# EAGLE design NEW_oct_6 (EAGLE 9.6.2)
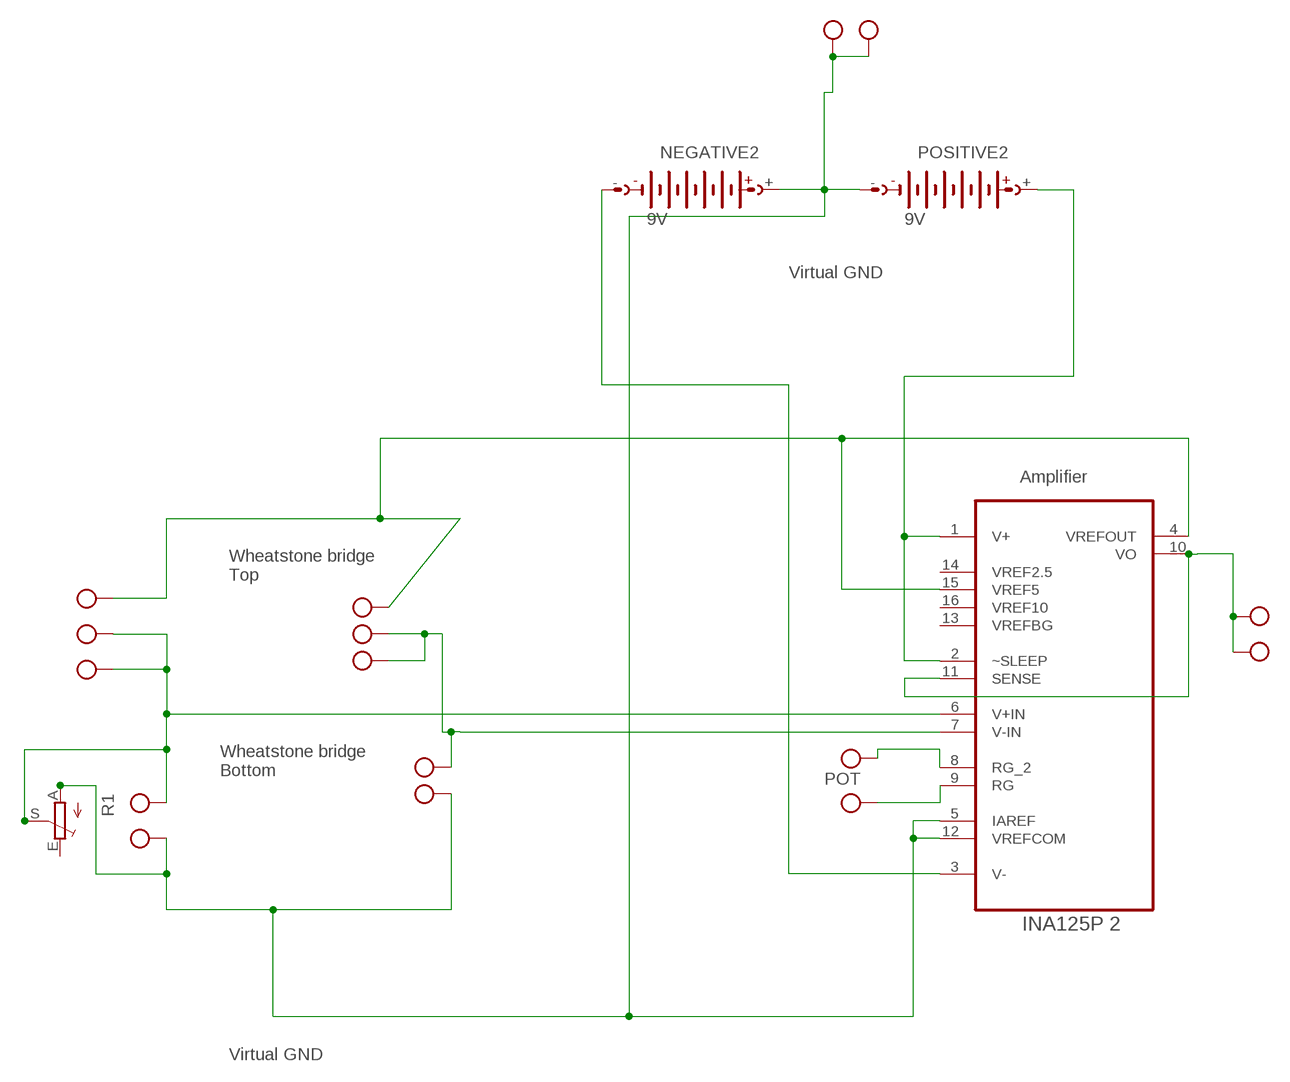
[diagram p0: schematic, sheet 1]

## Parts
FOURTH2  W237-102  [W237-102]
FOURTH5  W237-102  [W237-102]
FOURTH8  W237-102  [W237-102]
NEGATIVE2  AB9V  [AB9V]
POSITIVE2  AB9V  [AB9V]
POT2  W237-102  [W237-102]
R1  TRIM_EU-CT6  [CT6]
SECOND2  W237-102  [W237-102]
U3  INA125P 2  INA125P  [DIP254P762X508-16]
X1  W237-103  [W237-103]
X2  W237-103  [W237-103]

## Nets
N$1: R1.S SECOND2.1 U3.6(V+IN) X1.2 X1.3
N$18: FOURTH2.2 U3.7(V-IN) X2.1 X2.2
N$19: U3.4(VREFOUT) U3.15(VREF5) X1.1 X2.3
N$20: POSITIVE2.+ U3.1(V+) U3.2(~SLEEP)
N$21: NEGATIVE2.- U3.3(V-)
N$22: POT2.2 U3.9(RG)
N$23: POT2.1 U3.8(RG_2)
N$24: FOURTH5.1 FOURTH5.2 U3.10(VO) U3.11(SENSE)
N$27: FOURTH2.1 FOURTH8.1 FOURTH8.2 NEGATIVE2.+ POSITIVE2.- R1.A SECOND2.2 U3.5(IAREF) U3.12(VREFCOM)
Unconnected: R1.E

## Notes on the sheet
- 9V | 9V
- Virtual GND
- Amplifier
- Wheatstone bridge 
  Top
- Wheatstone bridge
  Bottom
- POT
- Virtual GND

## Power pins joined to a net without a drawn wire
VREF2.5: U3.14(VREF2.5)
VREF10: U3.16(VREF10)
VREFBG: U3.13(VREFBG)

## Library data of the parts
FOURTH2 FOURTH5 FOURTH8 POT2 SECOND2 = con-wago-500:W237-102: WAGO SCREW CLAMP; MPN: 237-102; OC_FARNELL: unknown; OC_NEWARK: 70K9898
NEGATIVE2 POSITIVE2 = battery:AB9V: 9-V BATTERY CLIP
R1 = pot redone by KG:TRIM_EU-: POTENTIOMETER
U3 = INA125P footprint:INA125P: INSTRUMENTATION AMPLIFIER; AVAILABILITY: Unavailable; DESCRIPTION: Instrumentation Amplifier 1 Circuit 16-PDIP; MF: Texas Instruments; MP: INA125P; PACKAGE: DIP-16 Burr Brown; PRICE: None
X1 X2 = con-wago-500:W237-103: WAGO SCREW CLAMP; MPN: 237-103; OC_FARNELL: unknown; OC_NEWARK: 18M7116

## Board
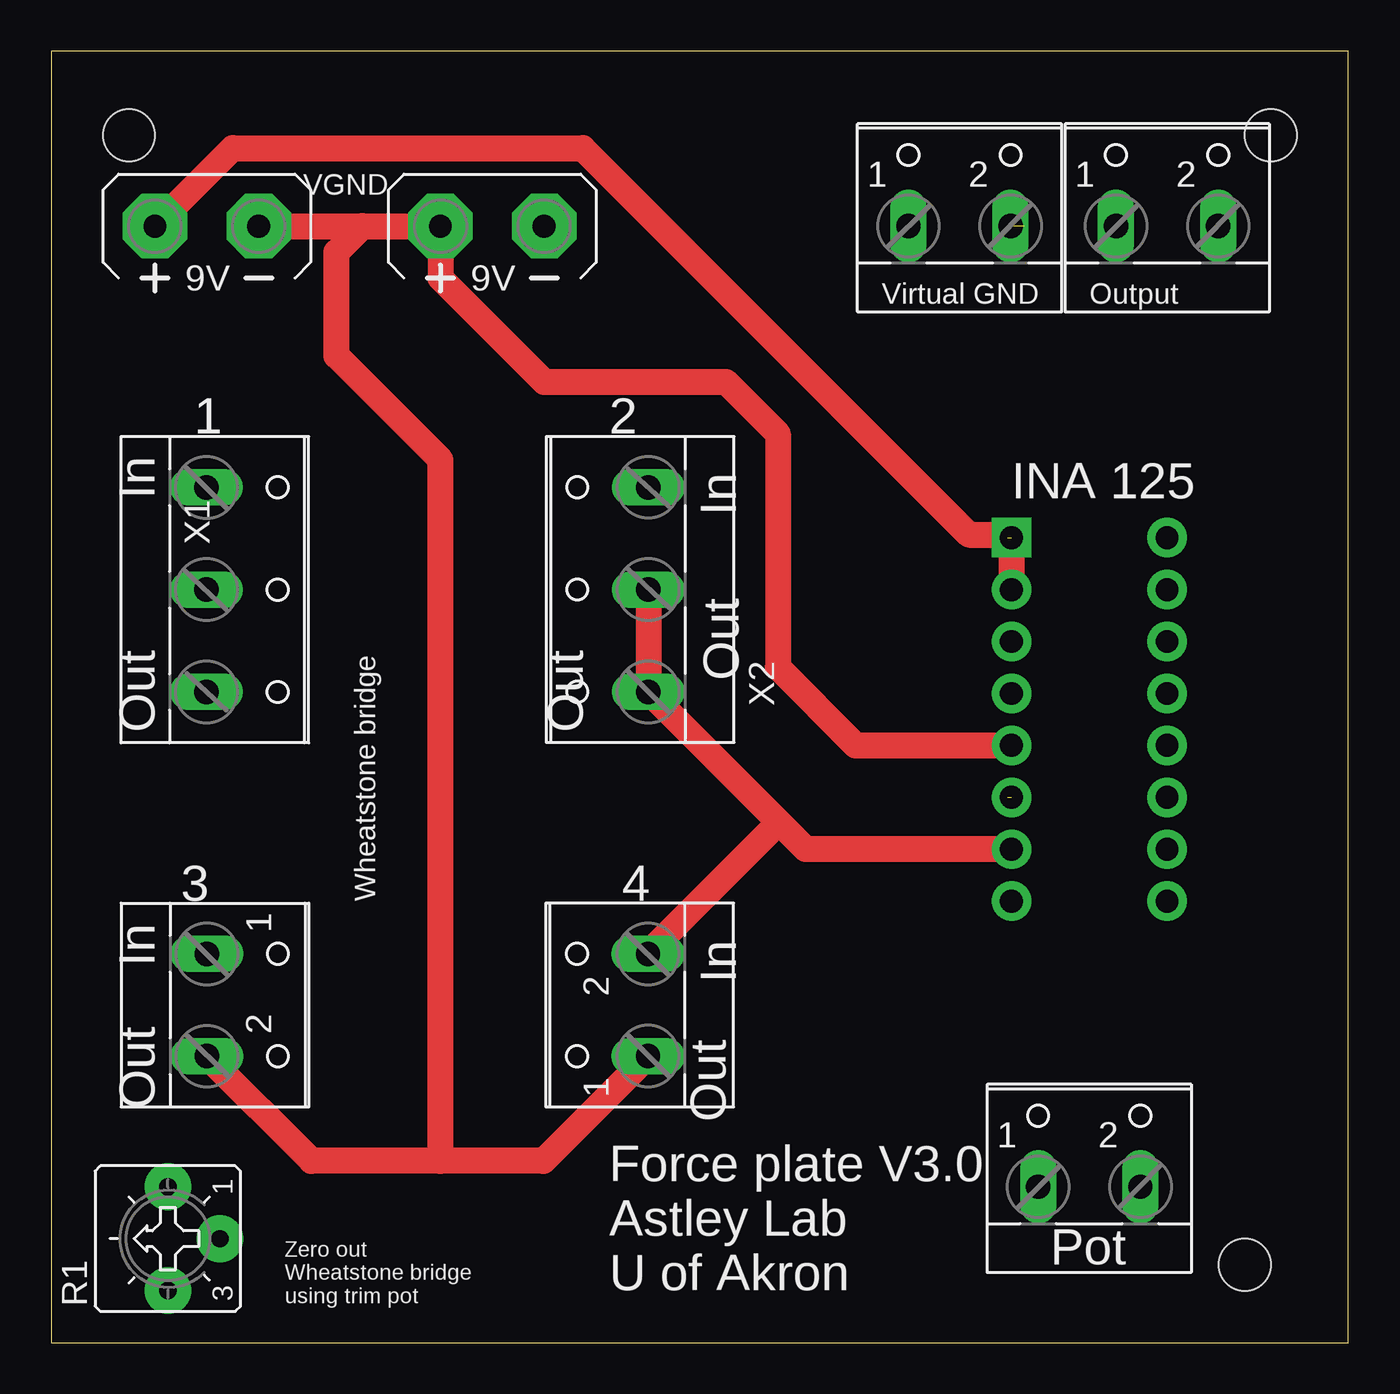
[diagram p1: board, top side]
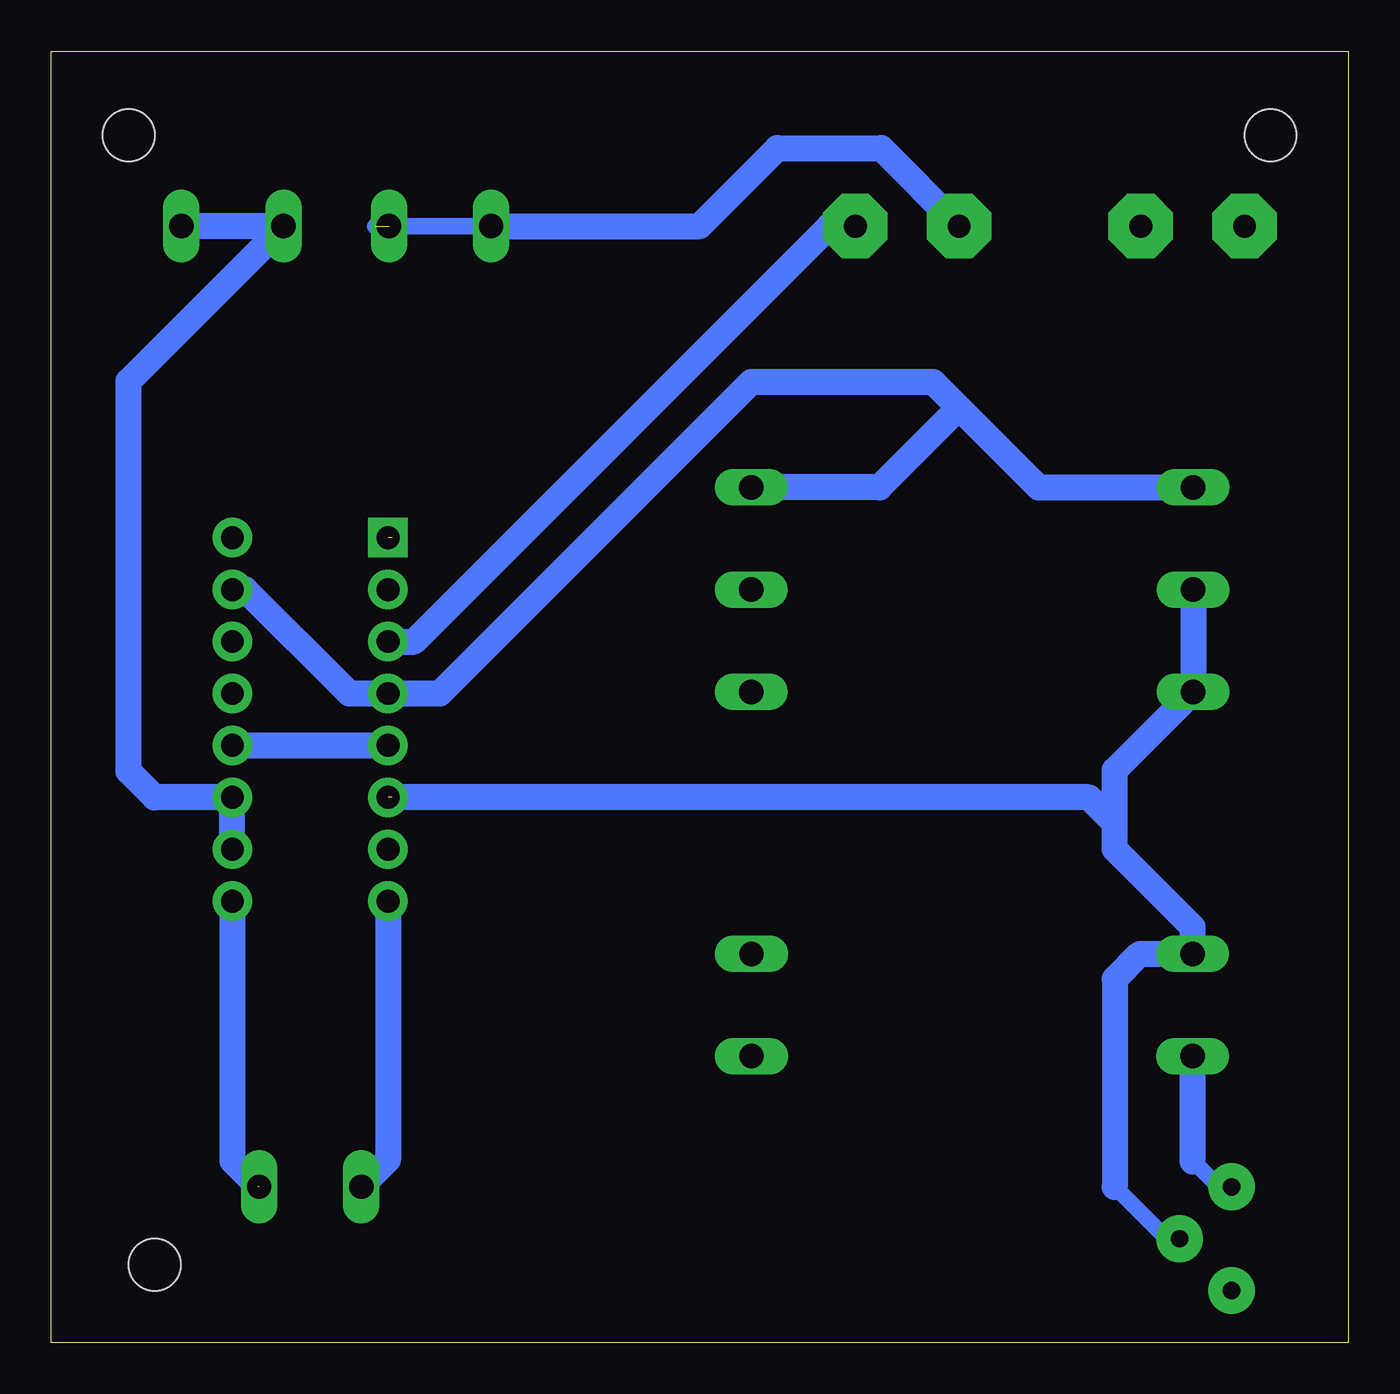
[diagram p2: board, bottom side, seen from below]

Size 63.48 x 63.17 mm. Coordinates in mm from the lower left corner, seen from the top.
Outline: 0,0 63.48,0 63.48,63.17 0,63.17 0,0
Copper layers (1*16): Top 0.035mm / dielectric 1.5mm / Bottom 0.035mm
Design rules "default *": minimum track width 6mil, minimum drill 0.35mm, track to track 500mil, track to pad 500mil, pad to pad 15mil, via to via 6mil, smd to smd 6mil, copper to edge 40mil, drill to drill 6mil, minimum pad ring 10mil, minimum via ring 8mil, stop-mask expansion 4mil, vias tented up to drill 0mil, thermal gap 10mil
Holes 2.54 mm at 58.42,3.81 3.81,59.05 59.69,59.05

### Footprints (pad centres in the part's own frame; a part is rotated, then mirrored left to right if it is on the bottom)
W237-102 = drill 1.194 long: 1 -2.5,-1.27; 2 2.5,-1.27
AB9V = drill 1.118 pad 3.15 octagon: + 0,2.54; - 0,-2.54
CT6 = drill 0.813 octagon: A 2.515,0; E -2.515,0; S 0,-2.54 | drill 0.85 pad 2.286: P$1 2.54,0; P$2 -2.54,0; P$3 0,-2.54
DIP254P762X508-16 = drill 1.118 pad 1.93 square: 1 -7.62,17.78 | drill 1.118 pad 1.93: 2 -7.62,15.24; 3 -7.62,12.7; 4 -7.62,10.16; 5 -7.62,7.62; 6 -7.62,5.08; 7 -7.62,2.54; 8 -7.62,0; 9 0,0; 10 0,2.54; 11 0,5.08; 12 0,7.62; 13 0,10.16; 14 0,12.7; 15 0,15.24; 16 0,17.78
W237-103 = drill 1.194 long: 1 -5,-1.29; 2 0,-1.29; 3 5,-1.29

### Placement (x,y rotation side)
FOURTH2  27.94,16.51 90 top
FOURTH5  54.61,55.88 0 top
FOURTH8  44.45,55.88 0 top
NEGATIVE2  21.59,54.61 90 top
POSITIVE2  7.62,54.61 90 top
POT2  50.8,8.89 0 top
R1  5.71,5.08 90 top
SECOND2  8.89,16.51 270 top
U3  54.61,21.59 0 top
X1  8.89,36.83 270 top
X2  27.94,36.83 90 top

### Tracks (layer width: path | path; a pad name or v marks a point on that pad's centre or on a via)
GND
  pour Top (isolate 0.001): 0,0.64 62.23,0.64 62.23,62.23 0.64,62.23 0.64,1.27
N$1  (1 unrouted)
  Bottom 0.813: 11.43,7.62 8.89,5.08 R1.S
  Bottom 1.27: 11.43,7.62 11.43,17.78 10.2,19.01 SECOND2.1 7.62,20.32 11.43,24.13 11.43,25.4 | 11.43,25.4 11.43,28 X1.3 X1.2 | 11.43,25.4 12.7,26.67 46.79,26.67
N$18
  Top 1.27: U3.7 36.93,24.13 35.61,25.45 | 35.61,25.45 X2.1 X2.2 | FOURTH2.2 29.21,19.05 35.61,25.45
N$19
  Bottom 1.27: U3.15 53.98,36.83 48.9,31.75 U3.4 44.45,31.75 29.21,46.99 20.32,46.99 19.05,45.72 | X2.3 22.94,41.83 19.05,45.72 | 19.05,45.72 15.16,41.83 X1.1
N$20  (1 unrouted)
  Top 1.27: POSITIVE2.+ 8.89,58.42 26.01,58.42 44.91,39.52 46.64,39.52 46.79,39.37 | U3.1 U3.2
N$21
  Bottom 1.27: U3.3 45.72,34.29 25.4,54.61 NEGATIVE2.-
N$22  (1 unrouted)
  Bottom 1.27: U3.9 54.61,8.89 53.34,7.62
N$23
  Bottom 1.27: U3.8 46.99,8.93 POT2.1
N$24
  Bottom 1.27: U3.10 U3.11 58.42,26.67 59.69,27.94 59.69,47.03 FOURTH5.1 FOURTH5.2
N$27  (1 unrouted)
  Top 1.27: POSITIVE2.- 15.24,54.61 | 15.24,54.61 NEGATIVE2.+ 19.05,52.07 24.13,46.99 33.02,46.99 35.56,44.45 35.56,33.02 39.37,29.21 U3.5 | FOURTH2.1 24.09,8.89 19.05,8.89 | SECOND2.2 12.74,8.89 19.05,8.89 | 19.05,8.89 19.05,43.18 13.97,48.26 13.97,53.34 15.24,54.61
  Bottom 0.813: FOURTH8.1 47.62,54.61 | 7.62,8.89 6.33,7.59 R1.A
  Bottom 1.27: U3.12 U3.5 | 7.62,8.87 7.62,8.89 SECOND2.2 | FOURTH8.1 31.75,54.61 27.94,58.42 22.86,58.42 NEGATIVE2.+
VGND
  pour Bottom (isolate 0.001): 0,0 62.87,0 62.87,61.59 1.91,61.59 1.27,60.96 1.27,1.27

### Text on the board
tNames: VGND | Virtual GND | Output | 1 | 2 | In | In | INA 125 | Out | Out | Out | 3 | Wheatstone bridge | 4 | In | In | Out | Out | Pot | Force plate V3.0 / Astley Lab / U of Akron | Zero out / Wheatstone bridge / using trim pot